# Altium schematic sheet BatteryManagement.SchDoc
size A4; SheetNumber: 3; SheetTotal: 3
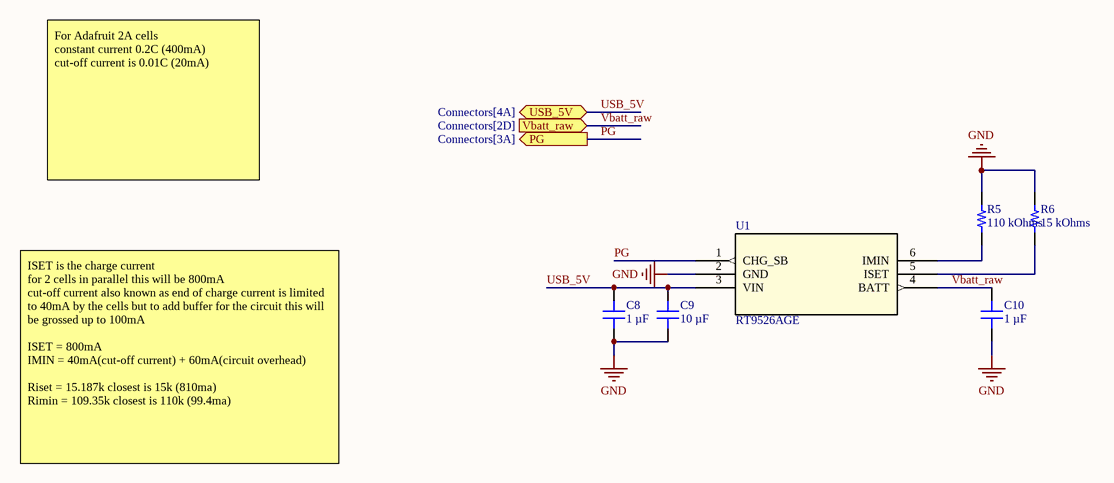
[diagram p0: BatteryManagement.SchDoc]

## Parts
C8  1 µF  [CAP 0603_1608]
C9  10 µF  [CAP 0603_1608]
C10  1 µF  [CAP 0603_1608]
R5  110 kOhms  [RES 0805_2012]
R6  15 kOhms  [RES 0805_2012]
U1  RT9526AGE  [SOT-23-6_RIT]

## Ports
PG (out, see Connectors[3A]), USB_5V (bidir, see Connectors[4A]), Vbatt_raw (in, see Connectors[2D])

## Nets
GND: C8.1 C9.1 C10.1 R5.2 R6.2 U1.2(GND)
PG: U1.1(CHG_SB) ; port PG
USB_5V: C8.2 C9.2 U1.3(VIN) ; port USB_5V
Vbatt_raw: C10.2 U1.4(BATT) ; port Vbatt_raw
NetR5_1: R5.1 U1.6(IMIN)
NetR6_1: R6.1 U1.5(ISET)

## Notes on the sheet
- For Adafruit 2A cells
  constant current 0.2C (400mA)
  cut-off current is 0.01C (20mA)
- ISET is the charge current
  for 2 cells in parallel this will be 800mA
  cut-off current also known as end of charge current is limited to 40mA by the cells but to add buffer for the circuit this will be grossed up to 100mA
  ISET = 800mA
  IMIN = 40mA(cut-off current) + 60mA(circuit overhead)
  Riset = 15.187k closest is 15k (810ma)
  Rimin = 109.35k closest is 110k (99.4ma)

## Library data of the parts
C8 C10 = C1608X7R1C105K080AC: CAP CER 1UF 16V X7R 0603; manufacturer: TDK Corporation; Tolerance: ±10%; Part Number: C1608X7R1C105K080AC; Value: 1 µF; Applications: General Purpose; Capacitance: 1 µF; componentlink1description: Datasheet; componentlink1url: https://product.tdk.com/info/en/catalog/datasheets/mlcc_commercial_general_en.pdf?ref_disty=digikey; componentlink2description: DigiKey Link; componentlink2url: https://www.digikey.com/en/products/detail/tdk-corporation/C1608X7R1C105K080AC/634395; Device Package: 0603 (1608 Metric); Features: Low ESL; lastupdated: 2023-01-03 8:06:54 PM; Lifecycle Status: Active; Minimum Order: 1; Mounting Type: Surface Mount, MLCC; Operating Temperature: -55°C ~ 125°C; Package / Case: 0603 (1608 Metric); packaging: TapeAndReel; partid: 36324; Part Status: Active; price: 0.01; series: C; Size / Dimension: 0.063" L x 0.031" W (1.60mm x 0.80mm); Supplier 1: DigiKey; Supplier Part Number 1: 445-1604-1-ND; Temperature Coefficient: X7R; Thickness (Max): 0.035" (0.90mm); Voltage - Rated: 16V
C9 = GRM188R61E106KA73J: CAP CER 10UF 25V X5R 0603; manufacturer: Murata Electronics; Tolerance: ±10%; Part Number: GRM188R61E106KA73J; Value: 10 µF; Applications: General Purpose; Capacitance: 10 µF; componentlink1description: Datasheet; componentlink1url: https://search.murata.co.jp/Ceramy/image/img/A01X/G101/ENG/GRM188R61E106KA73-01A.pdf; componentlink2description: DigiKey Link; componentlink2url: https://www.digikey.com/en/products/detail/murata-electronics/GRM188R61E106KA73J/9887674; Device Package: 0603 (1608 Metric); lastupdated: 2023-01-03 8:06:37 PM; Lifecycle Status: Active; Minimum Order: 1; Mounting Type: Surface Mount, MLCC; Operating Temperature: -55°C ~ 85°C; Package / Case: 0603 (1608 Metric); packaging: TapeAndReel; partid: 39529; Part Status: Active; price: 0.04; series: GRM; Size / Dimension: 0.063" L x 0.031" W (1.60mm x 0.80mm); Supplier 1: DigiKey; Supplier Part Number 1: 490-GRM188R61E106KA73JCT-ND; Temperature Coefficient: X5R; Thickness (Max): 0.039" (1.00mm); Voltage - Rated: 25V
R5 = RC0805FR-07110KL: RES 110K OHM 1% 1/8W 0805; Manufacturer: Yageo; Power (Watts): 0.125W, 1/8W; Temperature Coefficient: ±100ppm/°C; Part Number: RC0805FR-07110KL; Value: 110 kOhms; ComponentLink1Description: Datasheet; ComponentLink1URL: https://www.yageo.com/upload/media/product/productsearch/datasheet/rchip/PYu-RC_Group_51_RoHS_L_10.pdf; ComponentLink2Description: DigiKey Link; ComponentLink2URL: https://www.digikey.com/en/products/detail/yageo/RC0805FR-07110KL/727560; Composition: Thick Film; Device Package: 0805 (2012 Metric); Features: Moisture Resistant; Height - Seated (Max): 0.024" (0.60mm); LastUpdated: 2023-01-02 8:44:02 PM; Lifecycle Status: Active; Minimum Order: 1; Number of Terminations: 2; Operating Temperature: -55°C ~ 155°C; Package / Case: 0805 (2012 Metric); Packaging: CutTape; PartId: 39573; Part Status: Active; Price: 0.01; Resistance: 110 kOhms; Series: RC_L; Size / Dimension: 0.079" L x 0.049" W (2.00mm x 1.25mm); Supplier 1: DigiKey; Supplier Part Number 1: 311-110KCRCT-ND; Supplier Device Package: 0805; Tolerance: ±1%
R6 = RC0805FR-1315KL: RES 15K OHM 1% 1/8W 0805; Manufacturer: Yageo; Power (Watts): 0.125W, 1/8W; Temperature Coefficient: ±100ppm/°C; Part Number: RC0805FR-1315KL; Value: 15 kOhms; ComponentLink1Description: Datasheet; ComponentLink1URL: https://www.yageo.com/upload/media/product/productsearch/datasheet/rchip/PYu-RC_Group_51_RoHS_L_11.pdf; ComponentLink2Description: DigiKey Link; ComponentLink2URL: https://www.digikey.com/en/products/detail/yageo/RC0805FR-1315KL/13694228; Composition: Thick Film; Device Package: 0805 (2012 Metric); Features: Moisture Resistant; Height - Seated (Max): 0.024" (0.60mm); LastUpdated: 2023-01-02 8:42:49 PM; Lifecycle Status: Active; Minimum Order: 1; Number of Terminations: 2; Operating Temperature: -55°C ~ 155°C; Package / Case: 0805 (2012 Metric); Packaging: CutTape; PartId: 66554; Part Status: Active; Price: 0.01; Resistance: 15 kOhms; Series: RC_L; Size / Dimension: 0.079" L x 0.049" W (2.00mm x 1.25mm); Supplier 1: DigiKey; Supplier Part Number 1: 13-RC0805FR-1315KLCT-ND; Supplier Device Package: 0805; Tolerance: ±1%
U1 = RT9526AGE: No Description Available; Mfr_Name: Richtek Technology; Copyright: Copyright (C) 2023 Ultra Librarian. All rights reserved.; Manufacturer_Part_Number: RT9526AGE; Digi-Key_Part_Number_1: 1028-1359-2-ND; Digi-Key_Part_Number_2: 1028-1359-1-ND; Digi-Key_Part_Number_3: 1028-1359-6-ND; RefDes: RefDes; Type: DEV